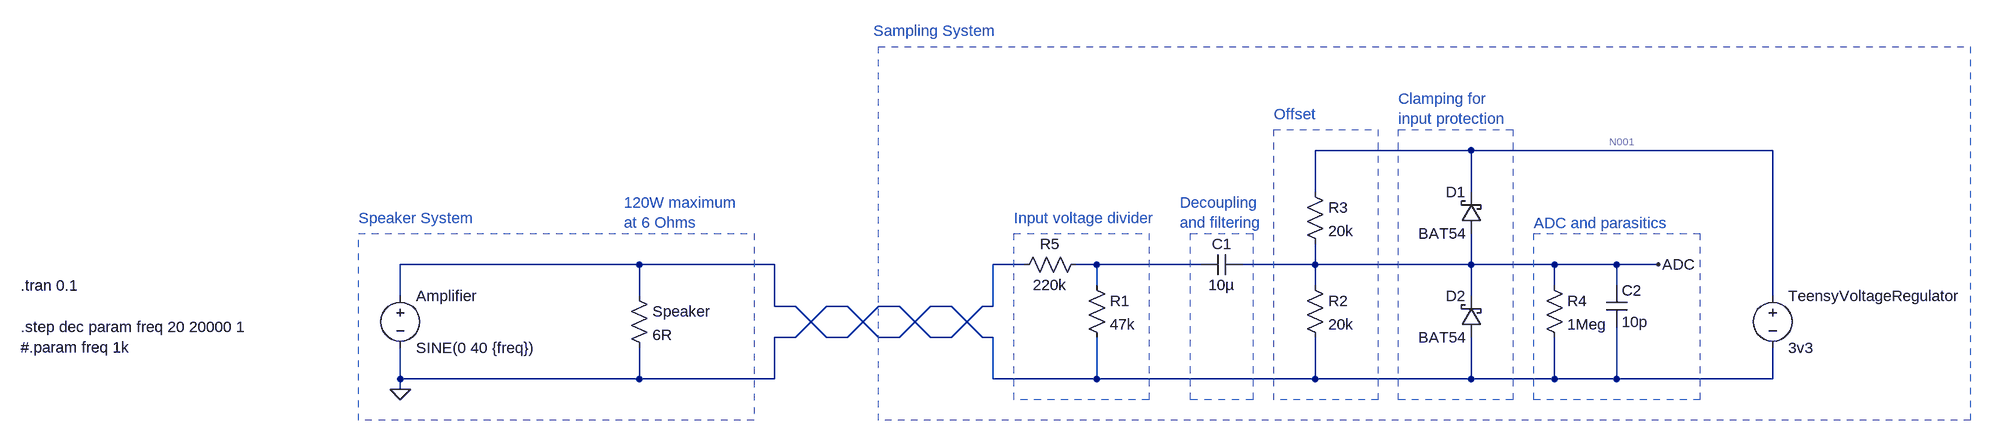
[diagram p0: schematic sampling_circuit.asc]
sampling_circuit.asc, the LTspice schematic file:
Version 4
SHEET 1 2452 680
WIRE 1296 -48 1056 -48
WIRE 1760 -48 1296 -48
WIRE 1056 16 1056 -48
WIRE 1296 16 1296 -48
WIRE 16 128 -352 128
WIRE 224 128 16 128
WIRE 608 128 560 128
WIRE 720 128 688 128
WIRE 880 128 720 128
WIRE 1056 128 1056 96
WIRE 1056 128 944 128
WIRE 1296 128 1296 80
WIRE 1296 128 1056 128
WIRE 1424 128 1296 128
WIRE 1520 128 1424 128
WIRE 1584 128 1520 128
WIRE 720 160 720 128
WIRE 1056 160 1056 128
WIRE 1424 160 1424 128
WIRE 1520 160 1520 128
WIRE -352 176 -352 128
WIRE 16 176 16 128
WIRE 1296 176 1296 128
WIRE 1760 176 1760 -48
WIRE 224 192 224 128
WIRE 256 192 224 192
WIRE 336 192 304 192
WIRE 416 192 384 192
WIRE 496 192 464 192
WIRE 560 192 560 128
WIRE 560 192 544 192
WIRE 256 240 304 192
WIRE 256 240 224 240
WIRE 304 240 256 192
WIRE 336 240 384 192
WIRE 336 240 304 240
WIRE 384 240 336 192
WIRE 416 240 464 192
WIRE 416 240 384 240
WIRE 464 240 416 192
WIRE 496 240 544 192
WIRE 496 240 464 240
WIRE 544 240 496 192
WIRE 560 240 544 240
WIRE -352 304 -352 256
WIRE 16 304 16 256
WIRE 16 304 -352 304
WIRE 224 304 224 240
WIRE 224 304 16 304
WIRE 560 304 560 240
WIRE 720 304 720 240
WIRE 720 304 560 304
WIRE 1056 304 1056 240
WIRE 1056 304 720 304
WIRE 1296 304 1296 240
WIRE 1296 304 1056 304
WIRE 1424 304 1424 240
WIRE 1424 304 1296 304
WIRE 1520 304 1520 224
WIRE 1520 304 1424 304
WIRE 1760 304 1760 256
WIRE 1760 304 1520 304
WIRE -352 320 -352 304
FLAG -352 320 0
FLAG 1584 128 ADC
SYMBOL voltage -352 160 R0
WINDOW 123 0 0 Left 2
WINDOW 39 0 0 Left 2
SYMATTR InstName Amplifier
SYMATTR Value SINE(0 40 {freq})
SYMBOL res 0 160 R0
SYMATTR InstName Speaker
SYMATTR Value 6R
SYMBOL res 704 144 R0
SYMATTR InstName R1
SYMATTR Value 47k
SYMBOL cap 944 112 R90
WINDOW 0 0 32 VBottom 2
WINDOW 3 32 32 VTop 2
SYMATTR InstName C1
SYMATTR Value 10µ
SYMBOL voltage 1760 160 R0
WINDOW 123 0 0 Left 2
WINDOW 39 0 0 Left 2
SYMATTR InstName TeensyVoltageRegulator
SYMATTR Value 3v3
SYMBOL res 704 112 R90
WINDOW 0 0 56 VBottom 2
WINDOW 3 32 56 VTop 2
SYMATTR InstName R5
SYMATTR Value 220k
SYMBOL res 1040 144 R0
SYMATTR InstName R2
SYMATTR Value 20k
SYMBOL res 1040 0 R0
SYMATTR InstName R3
SYMATTR Value 20k
SYMBOL cap 1504 160 R0
SYMATTR InstName C2
SYMATTR Value 10p
SYMBOL res 1408 144 R0
SYMATTR InstName R4
SYMATTR Value 1Meg
SYMBOL schottky 1312 80 R180
WINDOW 0 24 64 Left 2
WINDOW 3 24 0 Left 2
SYMATTR InstName D1
SYMATTR Value BAT54
SYMATTR Description Diode
SYMATTR Type diode
SYMBOL schottky 1312 240 R180
WINDOW 0 24 64 Left 2
WINDOW 3 24 0 Left 2
SYMATTR InstName D2
SYMATTR Value BAT54
SYMATTR Description Diode
SYMATTR Type diode
TEXT -936 224 Left 2 !.step dec param freq 20 20000 1\n#.param freq 1k
TEXT -936 160 Left 2 !.tran 0.1
TEXT -416 56 Left 2 ;Speaker System
TEXT 376 -232 Left 2 ;Sampling System
TEXT 592 56 Left 2 ;Input voltage divider
TEXT 848 32 Left 2 ;Decoupling\nand filtering
TEXT 992 -104 Left 2 ;Offset
TEXT 1392 64 Left 2 ;ADC and parasitics
TEXT -8 32 Left 2 ;120W maximum\nat 6 Ohms
TEXT 1184 -128 Left 2 ;Clamping for\ninput protection
RECTANGLE Normal 192 368 -416 80 2
RECTANGLE Normal 800 336 592 80 2
RECTANGLE Normal 960 336 864 80 2
RECTANGLE Normal 1152 336 992 -80 2
RECTANGLE Normal 1648 336 1392 80 2
RECTANGLE Normal 1360 336 1184 -80 2
RECTANGLE Normal 2064 368 384 -208 2

The netlist it stands for:
* sampling_circuit.asc
V§Amplifier N002 0 SINE(0 40 {freq})
R§Speaker N002 0 6R
R1 N003 0 47k
C1 ADC N003 10µ
V§TeensyVoltageRegulator N001 0 3v3
R5 N003 N002 220k
R2 ADC 0 20k
R3 N001 ADC 20k
C2 ADC 0 10p
R4 ADC 0 1Meg
D1 ADC N001 BAT54
D2 0 ADC BAT54
.model D D
.lib standard.dio
.step dec param freq 20 20000 1
#.param freq 1k
.tran 0.1
* Speaker System
* Sampling System
* Input voltage divider
* Decoupling
* and filtering
* Offset
* ADC and parasitics
* 120W maximum
* at 6 Ohms
* Clamping for
* input protection
.backanno
.end

* Results of the author's LTspice run, read from the files saved beside the schematic
* Operating Point (first step), zero values left out:
*   freq = 20 
*   V(adc) = 1.485 V
*   V(n001) = 3 V
*   I(D2) = -100 nA
*   I(D1) = -100 nA
*   I(R4) = 1.485 µA
*   I(R3) = 75.74 µA
*   I(R2) = 74.26 µA
*   I(Teensyvoltageregulator) = -75.84 µA
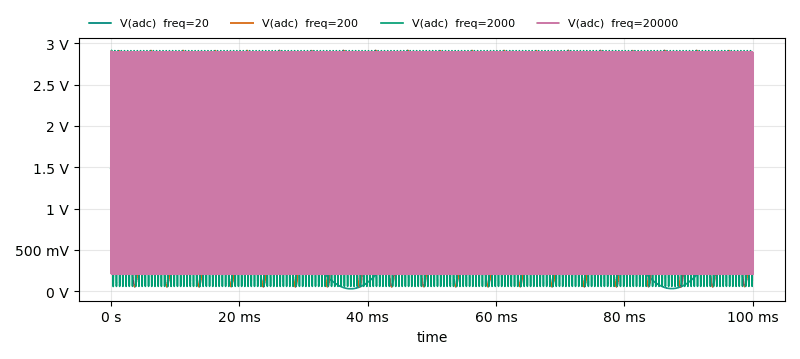
[diagram p1: Transient Analysis of sampling_circuit.asc, plotted from the saved traces]
* Transient Analysis, 4 runs:
*   V(adc) [freq=20]: min 30.04 mV, max 2.898 V, average 1.464 V, rms 1.781 V, last 1.489 V
*   V(adc) [freq=200]: min 52.79 mV, max 2.913 V, average 1.483 V, rms 1.794 V, last 1.485 V
*   V(adc) [freq=2000]: min 57.34 mV, max 2.913 V, average 1.482 V, rms 1.79 V, last 1.484 V
*   V(adc) [freq=20000]: min 56.03 mV, max 2.914 V, average 1.482 V, rms 1.79 V, last 1.471 V